# EAGLE schematic Solenoid System (EAGLE 9.3.0)
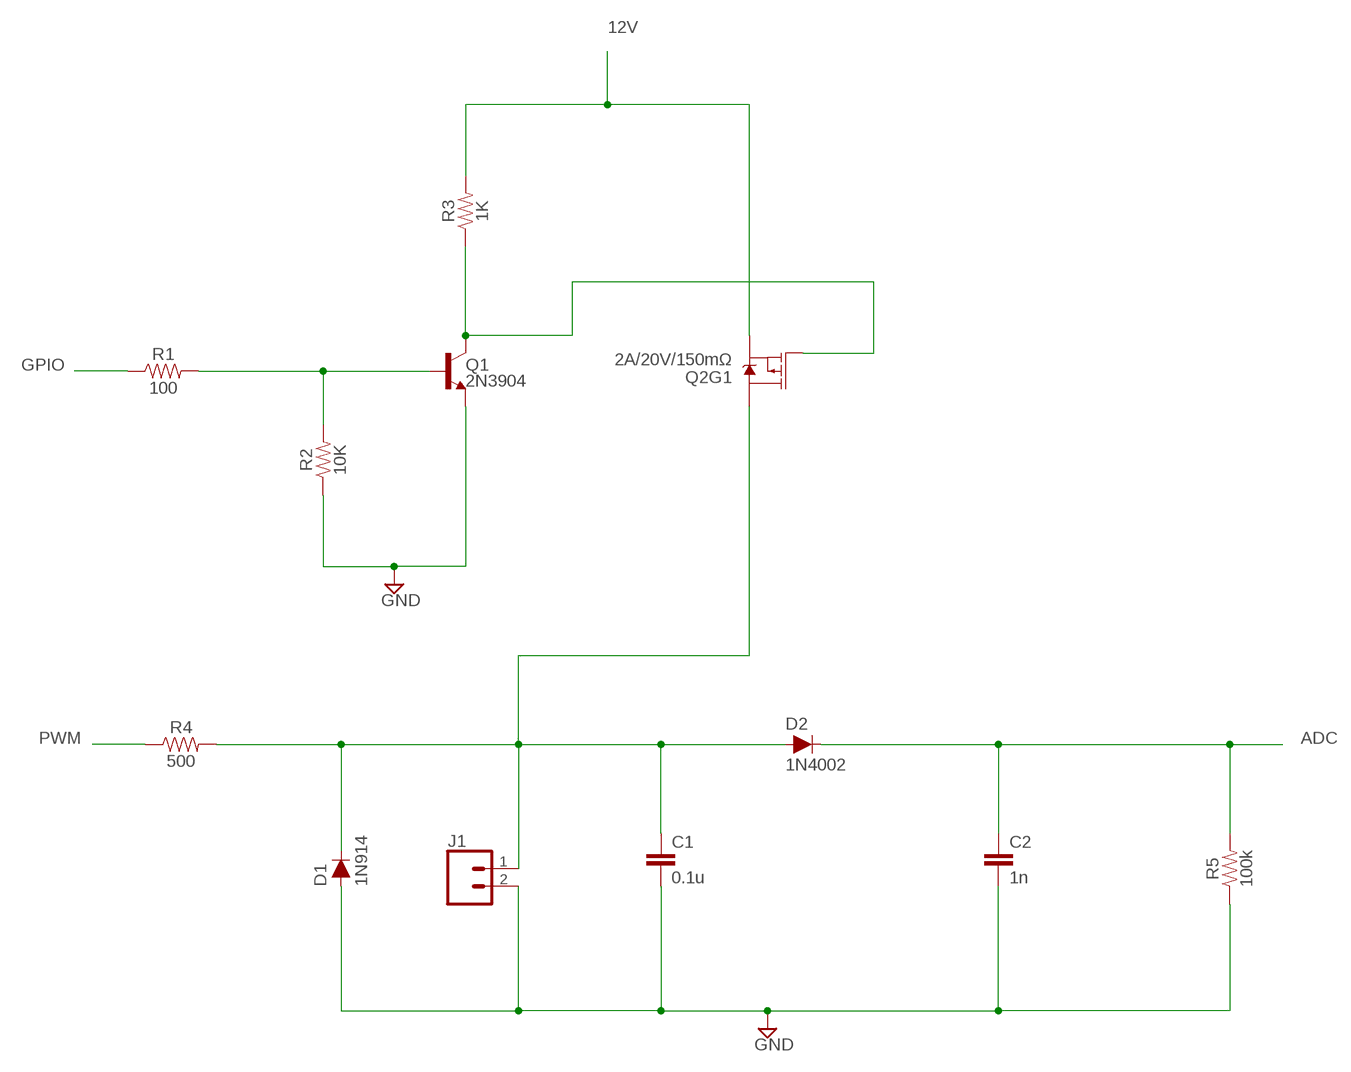
[diagram p0: schematic, sheet 1]

## Parts
C1  0.1u  10NF-0603-50V-10%  [0603]
C2  1n  10NF-0603-50V-10%  [0603]
D1  1N914  DIODE-BAS16J  [SOD-323]
D2  1N4002  DIODE-BAS16J  [SOD-323]
J1  CONN_02-JST-2MM-SMT  [JST-2-SMD]
Q1  2N3904  TRANS_NPN-MMBT2222AL  [SOT23-3]
Q2  2A/20V/150mΩ  MOSFET_PCH_DUAL-DMP2240UDM  [SOT26]
R1  100  10MOHM-0603-1/10W-5%  [0603]
R2  10K  10MOHM-0603-1/10W-5%  [0603]
R3  1K  10MOHM-0603-1/10W-5%  [0603]
R4  500  10MOHM-0603-1/10W-5%  [0603]
R5  100k  10MOHM-0603-1/10W-5%  [0603]

## Nets
12V: Q2.S1(S) R3.2
ADC: C2.1 D2.C R5.2
GND: C1.2 C2.2 D1.A J1.2 Q1.2(E) R2.1 R5.1
GPIO: R1.1
N$1: Q1.1(B) R1.2 R2.2
N$2: Q1.3(C) Q2.G1(G) R3.1
N$3: C1.1 D1.C D2.A J1.1 Q2.D1(D) R4.2
PWM: R4.1
Unconnected: Q2.D2(D) Q2.G2(G) Q2.S2(S)

## Library data of the parts
C1 C2 = SparkFun-Capacitors:10NF: 0.01uF/10nF/10,000pF ceramic capacitors A capacitor is a passive two-terminal electrical component used to store electrical energy temporarily in an electric field. CAP-09321; PROD_ID: CAP-00867; VALUE: 10nF
D1 D2 = SparkFun-DiscreteSemi:DIODE: Diode These are standard reverse protection diodes and small signal diodes. SparkFun Products: SparkFun SparkPunk Sound Kit <https://www.sparkfun.com/products/11177> SparkFun ESP8266 Thing <https://www.sparkfun.com/products/13231>; PROD_ID: DIO-09646; VALUE: 250mA/100V
J1 = SparkFun-Connectors:CONN_02: Multi connection point. Often used as Generic Header-pin footprint for 0.1 inch spaced/style header connections On any of the 0.1 inch spaced packages, you can populate with these: Break Away Headers - Straight <https://www.sparkfun.com/products/116> (PRT-00116) Break Away Male Headers - Right Angle <https://www.sparkfun.com/products/553> (PRT-00553) Female Headers <https://www.sparkfun.com/products/115> (PRT-00115) Break Away Headers - Machine Pin <https://www.sparkfun.com/products/117> (PRT-00117) Break Away Female Headers - Swiss Machine Pin <https://www.sparkfun.com/products/743> (PRT-00743) For SCREWTERMINALS and SPRING TERMINALS visit here: Screw Terimnals on SparkFun.com <https://www.sparkfun.com/search/results?term=Screw+Terminals> (5mm/3.5mm/2.54mm spacing) This device is also useful as a general connection point to wire up your design to another part of your project. Our various solder wires solder well into these plated through hole pads. Hook-Up Wire - Assortment (Stranded, 22 AWG) <https://www.sparkfun.com/products/11375> (PRT-11375) Hook-Up Wire - Assortment (Solid Core, 22 AWG) <https://www.sparkfun.com/products/11367> (PRT-11367) View the entire wire category on our website here <https://www.sparkfun.com/categories/141> Special notes: Molex polarized connector foot print use with: PRT-08233 with associated crimp pins and housings. 2.54_SCREWTERM for use with PRT-10571. 3.5mm Screw Terminal footprints for PRT-08084 5mm Screw Terminal footprints for use with PRT-08432; PROD_ID: CONN-11443
Q1 = SparkFun-DiscreteSemi:TRANS_NPN: NPN transistor Current controlled devices typically used to amplify current or used as a switch. BC547 - COM-08928 <http://www.sparkfun.com/products/8928> (TO-92 45V 100mA) (1.Collector 2.Base 3.Emitter) 2N3904 - COM-00521 <http://www.sparkfun.com/products/521> (TO-92 40V 200mA) (1.Emitter 2.Base 3.Collector) P2N2222A - COM-12852 <http://www.sparkfun.com/products/12852> (TO-92 40V 600mA) (1.Collector 2.Base 3.Emitter); PROD_ID: TRANS-08049; VALUE: 600mA/40V
Q2 = SparkFun-DiscreteSemi:MOSFET_PCH_DUAL: Dual P-Channel -20VDS MOSFET Link to datasheet <http://www.diodes.com/_files/datasheets/ds31197.pdf> SparkFun Products: SparkFun FreeSoC2 Development Board <https://www.sparkfun.com/products/13229>; PROD_ID: TRANS-12444
R1-R5 = SparkFun-Resistors:10MOHM: RES-09327; PROD_ID: RES-08283; VALUE: 10M